# EAGLE schematic LVMi Pressure Sensor (EAGLE 9.6.2)
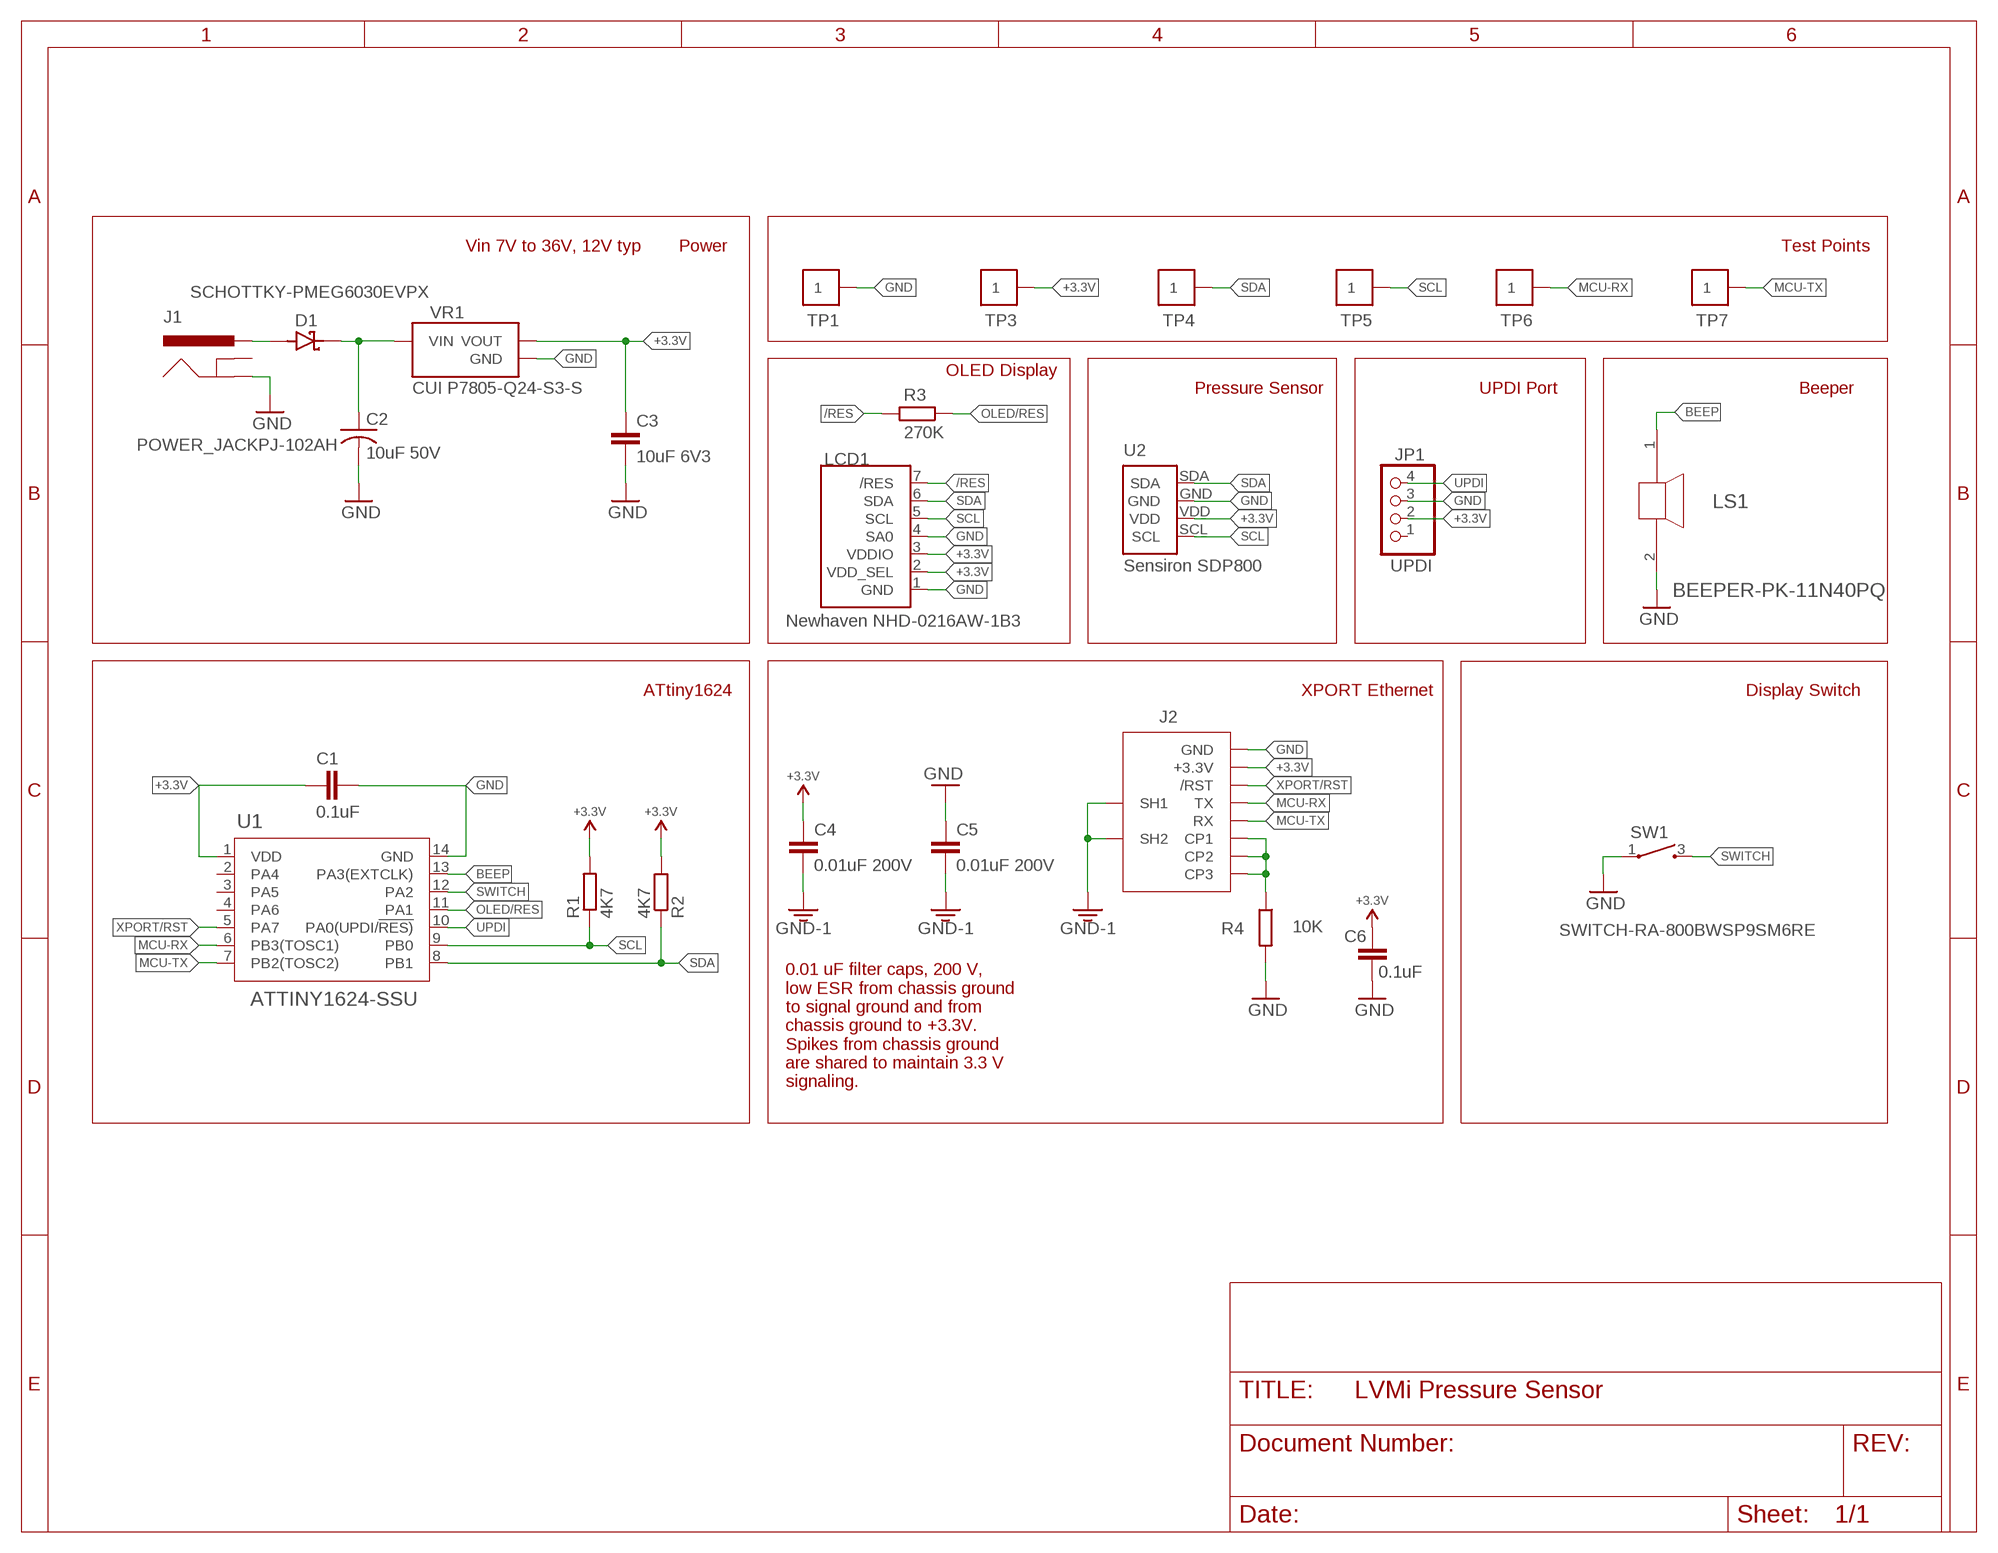
[diagram p0: schematic, sheet 1]

## Parts
C1  0.1uF  C-EUC0805  [C0805]
C2  10uF 50V  C-USC1210  [C1210]
C3  10uF 6V3  C-EUC0805  [C0805]
C4  0.01uF 200V  C-EUC0805  [C0805]
C5  0.01uF 200V  C-EUC0805  [C0805]
C6  0.1uF  C-EUC0805  [C0805]
D1  SCHOTTKY-PMEG6030EVPX  [DIO_PMEG6030EVPX]
J1  POWER_JACKPJ-102AH  [PJ-102AH]
J2  XPORTXPORT-2  [XPORT-2]
JP1  UPDI  PINHD-1X4/90  [1X04/90]
LCD1  Newhaven NHD-0216AW-1B3  LCD-NEWHAVEN-16X2  [LCD-NEWHAVEN-16X2]
LS1  BEEPER-PK-11N40PQ  [PK-11N40PQ_MAL]
R1  4K7  R-EU_R0805  [R0805]
R2  4K7  R-EU_R0805  [R0805]
R3  270K  R-EU_R0805  [R0805]
R4  10K  R-EU_R0805  [R0805]
SW1  SWITCH-RA-800BWSP9SM6RE  [SWITCH-RA-800BWSP9SM6RE]
TP1  GND  TP5000-TESTPOINT-BLK  [TP5000-TESTPOINT-BLK]
TP3  +3.3V  TP5000-TESTPOINT-PUR  [TP5000-TESTPOINT-PUR]
TP4  SDA  TP5000-TESTPOINT-YEL  [TP5000-TESTPOINT-YEL]
TP5  SCL  TP5000-TESTPOINT-WHI  [TP5000-TESTPOINT-WHI]
TP6  MCU-RX  TP5000-TESTPOINT-WHI  [TP5000-TESTPOINT-WHI]
TP7  MCU-TX  TP5000-TESTPOINT-WHI  [TP5000-TESTPOINT-WHI]
U1  ATTINY1624-SSU  ATTINY1624-SSUSOIC150-14_MCH-M  [SOIC150-14_MCH-M]
U2  Sensiron SDP800  SDP800_PRESSURE_SENSOR  [SDP800_PRESSURE_SENSOR]
VR1  CUI P7805-Q24-S3-S  P7805-Q24-S3-S  [CONV_P7805-Q24-S3-S]

## Nets
+3.3V: C1.1 C3.1 C4.1 C6.2 J2.3.3V(+3.3V) JP1.2 LCD1.2(VDD_SEL) LCD1.3(VDDIO) R1.2 R2.2 TP3.P$1 U1.1(VDD) U2.VDD VR1.VOUT
/RES: LCD1.7(/RES) R3.2
BEEP: LS1.1 U1.13(PA3(EXTCLK))
GND: C1.2 C2.2 C3.2 C5.1 C6.1 J1.GND J2.GND JP1.3 LCD1.1(GND) LCD1.4(SA0) LS1.2 R4.2 SW1.1 TP1.P$1 U1.14(GND) U2.GND VR1.GND
GND-1: C4.2 C5.2 J2.P$1(SH1) J2.P$2(SH2)
MCU-RX: J2.TX TP6.P$1 U1.6(PB3(TOSC1))
MCU-TX: J2.RX TP7.P$1 U1.7(PB2(TOSC2))
OLED/RES: R3.1 U1.11(PA1)
SCL: LCD1.5(SCL) R1.1 TP5.P$1 U1.9(PB0) U2.SCL
SDA: LCD1.6(SDA) R2.1 TP4.P$1 U1.8(PB1) U2.SDA
SWITCH: SW1.3 U1.12(PA2)
UPDI: JP1.4 U1.10(PA0(UPDI/!RES))
VIN: C2.1 D1.1(K) VR1.VIN
VSUP: D1.2(A) J1.PWR
XP-CP: J2.CP1 J2.CP2 J2.CP3 R4.1
XPORT/RST: J2./RST U1.5(PA7)
Unconnected: J1.GNDBRK(GNDBREAK) JP1.1 U1.2(PA4) U1.3(PA5) U1.4(PA6)

## Notes on the sheet
- Vin 7V to 36V, 12V typ | Power | Test Points
- OLED Display
- Pressure Sensor | UPDI Port | Beeper
- ATtiny1624 | XPORT Ethernet | Display Switch
- 0.01 uF filter caps, 200 V,
  low ESR from chassis ground
  to signal ground and from
  chassis ground to +3.3V.
  Spikes from chassis ground
  are shared to maintain 3.3 V
  signaling.

## Library data of the parts
C1 C3-C6 = AUmlib:C-EU: CAPACITOR, European symbol; SPICEPREFIX: C
C2 = AUmlib:C-US: CAPACITOR, American symbol; SPICEPREFIX: C
D1 = AUmlib:SCHOTTKY-PMEG6030EVPX: PMEG6030 Series 60 V 3 A Surface Mount Schottky Barrier Rectifier - SOD-128; DESCRIPTION: Diode Schottky 60V 3A Surface Mount SOD-128/CFP5; DIGI-KEY_PART_NUMBER: 1727-1349-1-ND; MF: Nexperia USA; MP: PMEG6030EVPX; PACKAGE: CFP5-2 Nexperia USA Inc.; PURCHASE-URL: https://pricing.snapeda.com/search/part/PMEG6030EVPX/?ref=eda
J1 = AUmlib:POWER_JACK: Power Jack Connector The CUI PJ-102AH has smaller tabs and a 2.1 mm opening for a 2.0 mm pin. This is the standard 5.5mm barrel jack for power. The PTH is the most common, proven, reliable, footprint. The Slot footprint only works if the mill layer is transmitted to the PCB fab house so be warned. Here are the connectors we sell at SparkFun: DC Barrel Power Jack/Connector <https://www.sparkfun.com/products/119> (PRT-00119) DC Barrel Power Jack/Connector (SMD) <https://www.sparkfun.com/products/12748> (PRT-12748) DC Barrel Jack Adapter - Breadboard Compatible <https://www.sparkfun.com/products/10811> (PRT-10811) It is used on this SparkFun product (and many, many others): SparkFun RedBoard - Programmed with Arduino <https://www.sparkfun.com/products/12757> (DEV-12757) Also, if you need a mating power supply or connector, please check these out: Wall Adapter Power Supply - 9VDC 650mA <https://www.sparkfun.com/products/298> (TOL-00298) DC Barrel Jack Adapter - Male <https://www.sparkfun.com/products/10287> (PRT-10287)
J2 = AUmlib:XPORT
JP1 = AUmlib:PINHD-1X4: PIN HEADER
LCD1 = AUmlib:LCD-NEWHAVEN-16X2: Newhaven I2C LCD 16x2
LS1 = AUmlib:BEEPER-PK-11N40PQ; COPYRIGHT: Copyright (C) 2022 Ultra Librarian. All rights reserved.; DIGI-KEY_PART_NUMBER_1: 458-1342-ND; MANUFACTURER_PART_NUMBER: PK-11N40PQ; MFR_NAME: Mallory Sonalert
R1-R4 = AUmlib:R-EU_: RESISTOR, European symbol; SPICEPREFIX: R
SW1 = AUmlib:SWITCH-RA-800BWSP9SM6RE: Surface mount pushbutton right angle momentary on switch
TP1 = AUmlib:TP5000-TESTPOINT-BLK
TP3 = AUmlib:TP5000-TESTPOINT-PUR
TP4 = AUmlib:TP5000-TESTPOINT-YEL
TP5-TP7 = AUmlib:TP5000-TESTPOINT-WHI
U1 = AUmlib:ATTINY1624-SSU; COPYRIGHT: Copyright (C) 2022 Ultra Librarian. All rights reserved.; DIGI-KEY_PART_NUMBER_1: 150-ATTINY1624-SSU-ND; MANUFACTURER_PART_NUMBER: ATTINY1624-SSU; MFR_NAME: Microchip
U2 = AUmlib:SDP800_PRESSURE_SENSOR: SDP800 Differential Pressure Sensor
VR1 = AUmlib:P7805-Q24-S3-S: CUI P7805-Q24-S3-S DC-DC Converter 3.3V 2W Digikey 102-2704-ND $4.94 2020-09-14; AVAILABILITY: Good; DESCRIPTION: 3.3V 2W; MF: CUI; MP: P7805-Q12-S1R5-S; PACKAGE: SIP-3 CUI; PRICE: $4.94